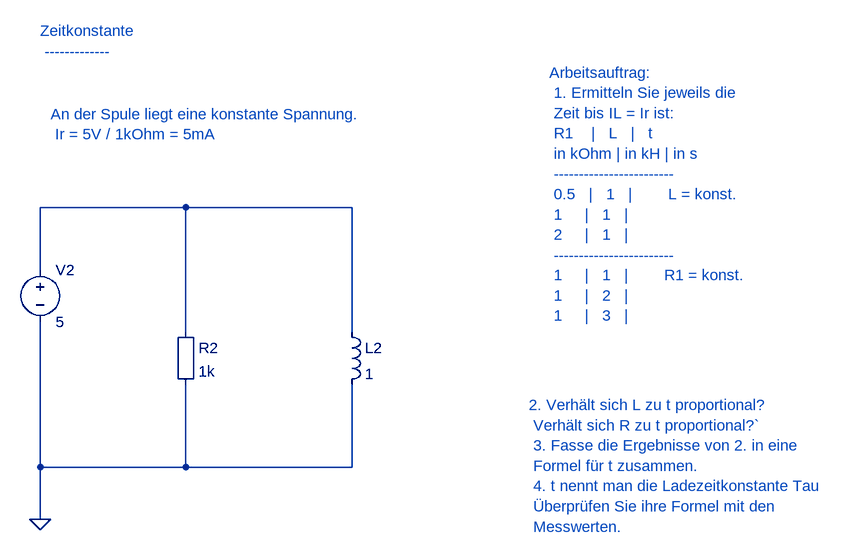
[diagram p0: schematic 1_2_2_L_Zeitkonstante.asc]
1_2_2_L_Zeitkonstante.asc, the LTspice schematic file:
Version 4
SHEET 1 880 680
WIRE 144 512 144 528
WIRE 368 608 368 736
WIRE 368 528 368 336
WIRE 368 336 624 336
WIRE 624 336 624 528
WIRE 144 432 144 336
WIRE 144 336 368 336
WIRE 144 736 144 816
WIRE 144 528 144 736
WIRE 368 736 144 736
WIRE 624 608 624 736
WIRE 624 736 368 736
FLAG 144 816 0
SYMBOL Misc\EuropeanResistor 352 512 R0
SYMATTR InstName R2
SYMATTR Value 1k
SYMBOL ind 608 512 R0
SYMATTR InstName L2
SYMATTR Value 1
SYMBOL voltage 144 416 R0
SYMATTR InstName V2
SYMATTR Value 5
TEXT 160 192 Left 2 ;An der Spule liegt eine konstante Spannung. \n Ir = 5V / 1kOhm = 5mA
TEXT 896 640 Left 2 ;2. Verhält sich L zu t proportional? \n Verhält sich R zu t proportional?` \n 3. Fasse die Ergebnisse von 2. in eine \n Formel für t zusammen. \n 4. t nennt man die Ladezeitkonstante Tau \n Überprüfen Sie ihre Formel mit den \n Messwerten.
TEXT 928 128 Left 2 ;Arbeitsauftrag: \n 1. Ermitteln Sie jeweils die \n Zeit bis IL = Ir ist: \n R1    |   L   |   t \n in kOhm | in kH | in s \n ------------------------ \n 0.5   |   1   |        L = konst. \n 1     |   1   | \n 2     |   1   | \n ------------------------ \n 1     |   1   |        R1 = konst. \n 1     |   2   | \n 1     |   3   |
TEXT 144 64 Left 2 ;Zeitkonstante \n -------------

The netlist it stands for:
* 1_2_2_L_Zeitkonstante.asc
R2 N001 0 1k
L2 N001 0 1
V2 N001 0 5
* An der Spule liegt eine konstante Spannung.
*  Ir = 5V / 1kOhm = 5mA
* 2. Verhält sich L zu t proportional?
*  Verhält sich R zu t proportional?`
*  3. Fasse die Ergebnisse von 2. in eine
*  Formel für t zusammen.
*  4. t nennt man die Ladezeitkonstante Tau
*  Überprüfen Sie ihre Formel mit den
*  Messwerten.
* Arbeitsauftrag:
*  1. Ermitteln Sie jeweils die
*  Zeit bis IL = Ir ist:
*  R1    |   L   |   t
*  in kOhm | in kH | in s
*  ------------------------
*  0.5   |   1   |        L = konst.
*  1     |   1   |
*  2     |   1   |
*  ------------------------
*  1     |   1   |        R1 = konst.
*  1     |   2   |
*  1     |   3   |
* Zeitkonstante
*  -------------
.backanno
.end